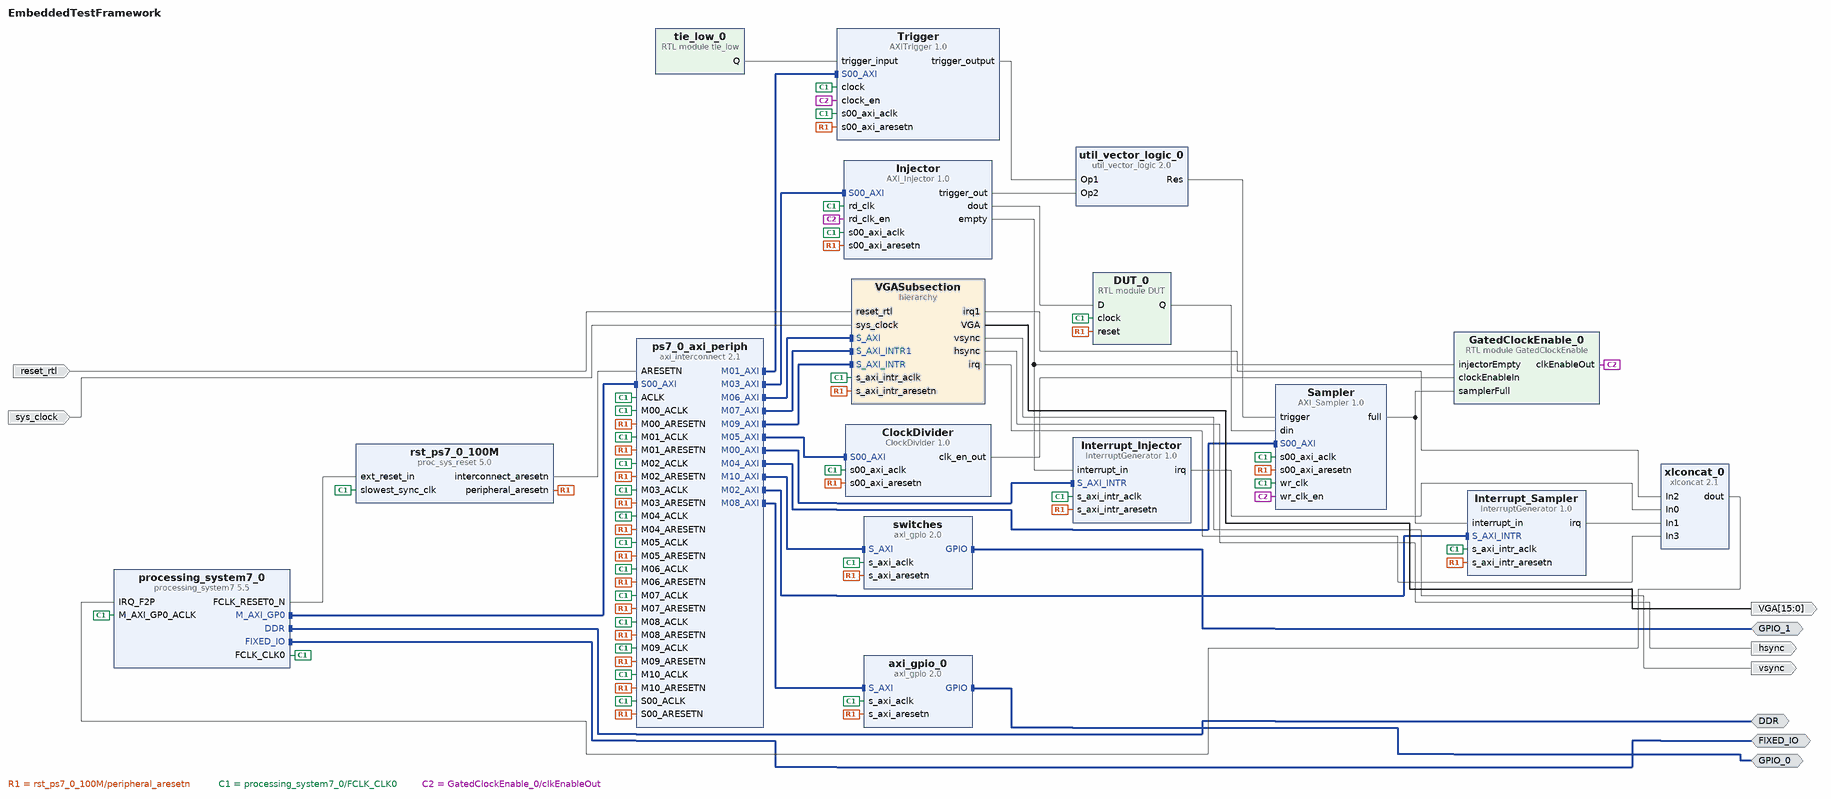
[diagram p0: block diagram of the top level]
# Vivado block design EmbeddedTestFramework, xc7z010clg400-1, Vivado 2018.2
create_bd_design EmbeddedTestFramework

create_bd_intf_port -mode Master -vlnv xilinx.com:interface:ddrx_rtl:1.0 DDR
create_bd_intf_port -mode Master -vlnv xilinx.com:display_processing_system7:fixedio_rtl:1.0 FIXED_IO
create_bd_intf_port -mode Master -vlnv xilinx.com:interface:gpio_rtl:1.0 GPIO_1
create_bd_intf_port -mode Master -vlnv xilinx.com:interface:gpio_rtl:1.0 GPIO_0
create_bd_port -dir I -type rst reset_rtl
set_property -dict {CONFIG.POLARITY ACTIVE_HIGH} [get_bd_ports reset_rtl]
create_bd_port -dir I -type clk sys_clock
set_property -dict {CONFIG.FREQ_HZ 125000000 CONFIG.PHASE 0.000} [get_bd_ports sys_clock]
create_bd_port -dir O -from 15 -to 0 VGA
create_bd_port -dir O vsync
create_bd_port -dir O hsync

create_bd_cell -type ip -vlnv xilinx.com:ip:xlconcat:2.1 xlconcat_0
set_property -dict {CONFIG.NUM_PORTS 4} [get_bd_cells xlconcat_0]
create_bd_cell -type ip -vlnv xilinx.com:ip:axi_interconnect:2.1 ps7_0_axi_periph
set_property -dict [list \
  CONFIG.NUM_MI 11 \
  CONFIG.STRATEGY 2 \
  CONFIG.ENABLE_ADVANCED_OPTIONS 1 \
  CONFIG.M00_HAS_REGSLICE 3 \
  CONFIG.M01_HAS_REGSLICE 3 \
  CONFIG.M02_HAS_REGSLICE 3 \
  CONFIG.M03_HAS_REGSLICE 3 \
  CONFIG.M04_HAS_REGSLICE 3 \
  CONFIG.M05_HAS_REGSLICE 3 \
  CONFIG.M06_HAS_REGSLICE 3 \
  CONFIG.M07_HAS_REGSLICE 3 \
  CONFIG.M08_HAS_REGSLICE 3 \
  CONFIG.M09_HAS_REGSLICE 3 \
  CONFIG.M10_HAS_REGSLICE 3 \
  CONFIG.M00_HAS_DATA_FIFO 0 \
  CONFIG.M01_HAS_DATA_FIFO 0 \
  CONFIG.M02_HAS_DATA_FIFO 0 \
  CONFIG.M03_HAS_DATA_FIFO 0 \
  CONFIG.M04_HAS_DATA_FIFO 0 \
  CONFIG.M05_HAS_DATA_FIFO 0 \
  CONFIG.M06_HAS_DATA_FIFO 0 \
  CONFIG.M07_HAS_DATA_FIFO 0 \
  CONFIG.M08_HAS_DATA_FIFO 0 \
  CONFIG.M09_HAS_DATA_FIFO 0 \
  CONFIG.M10_HAS_DATA_FIFO 0 \
  CONFIG.S00_HAS_DATA_FIFO 2 \
] [get_bd_cells ps7_0_axi_periph]
create_bd_cell -type module -reference tie_low tie_low_0
create_bd_cell -type module -reference DUT DUT_0
create_bd_cell -type hier VGASubsection
create_bd_cell -type module -reference GatedClockEnable GatedClockEnable_0
create_bd_cell -type ip -vlnv xilinx.com:ip:util_vector_logic:2.0 util_vector_logic_0
set_property -dict {CONFIG.C_SIZE 2 CONFIG.C_OPERATION or} [get_bd_cells util_vector_logic_0]
create_bd_cell -type ip -vlnv xilinx.com:ip:axi_gpio:2.0 axi_gpio_0
set_property -dict [list \
  CONFIG.C_GPIO_WIDTH 4 \
  CONFIG.USE_BOARD_FLOW true \
  CONFIG.GPIO_BOARD_INTERFACE Custom \
  CONFIG.C_ALL_OUTPUTS 1 \
] [get_bd_cells axi_gpio_0]
create_bd_cell -type ip -vlnv xilinx.com:ip:axi_gpio:2.0 switches
set_property -dict {CONFIG.C_GPIO_WIDTH 4 CONFIG.C_ALL_INPUTS 1} [get_bd_cells switches]
create_bd_cell -type ip -vlnv xilinx.com:ip:processing_system7:5.5 processing_system7_0
set_property -dict [list \
  CONFIG.PCW_UIPARAM_DDR_FREQ_MHZ 525 \
  CONFIG.PCW_CRYSTAL_PERIPHERAL_FREQMHZ 50.000000 \
  CONFIG.PCW_APU_PERIPHERAL_FREQMHZ 650 \
  CONFIG.PCW_UART_PERIPHERAL_FREQMHZ 100 \
  CONFIG.PCW_FPGA0_PERIPHERAL_FREQMHZ 200 \
  CONFIG.PCW_FPGA1_PERIPHERAL_FREQMHZ 50 \
  CONFIG.PCW_USE_FABRIC_INTERRUPT 1 \
  CONFIG.PCW_IRQ_F2P_INTR 1 \
  CONFIG.PCW_PERIPHERAL_BOARD_PRESET part0 \
  CONFIG.PCW_PRESET_BANK1_VOLTAGE {LVCMOS 1.8V} \
  CONFIG.PCW_UIPARAM_DDR_PARTNO {MT41K128M16 JT-125} \
  CONFIG.PCW_QSPI_PERIPHERAL_ENABLE 0 \
  CONFIG.PCW_ENET0_PERIPHERAL_ENABLE 0 \
  CONFIG.PCW_SD0_PERIPHERAL_ENABLE 0 \
  CONFIG.PCW_UART1_PERIPHERAL_ENABLE 1 \
  CONFIG.PCW_UART1_UART1_IO {MIO 48 .. 49} \
  CONFIG.PCW_USB0_PERIPHERAL_ENABLE 0 \
  CONFIG.PCW_GPIO_MIO_GPIO_ENABLE 0 \
] [get_bd_cells processing_system7_0]
# 343 more settings of processing_system7_0 are not shown: defaults, MIO pin electricals, DDR timing, and values the tool derives
create_bd_cell -type ip -vlnv xilinx.com:ip:proc_sys_reset:5.0 rst_ps7_0_100M
create_bd_cell -type ip -vlnv xilinx.com:user:AXITrigger:1.0 Trigger
create_bd_cell -type ip -vlnv xilinx.com:user:AXI_Injector:1.0 Injector
create_bd_cell -type ip -vlnv xilinx.com:user:AXI_Sampler:1.0 Sampler
create_bd_cell -type ip -vlnv xilinx.com:user:ClockDivider:1.0 ClockDivider
create_bd_cell -type ip -vlnv xilinx.com:user:InterruptGenerator:1.0 Interrupt_Injector
create_bd_cell -type ip -vlnv xilinx.com:user:InterruptGenerator:1.0 Interrupt_Sampler

# ---- hierarchy /VGASubsection ----
current_bd_instance /VGASubsection
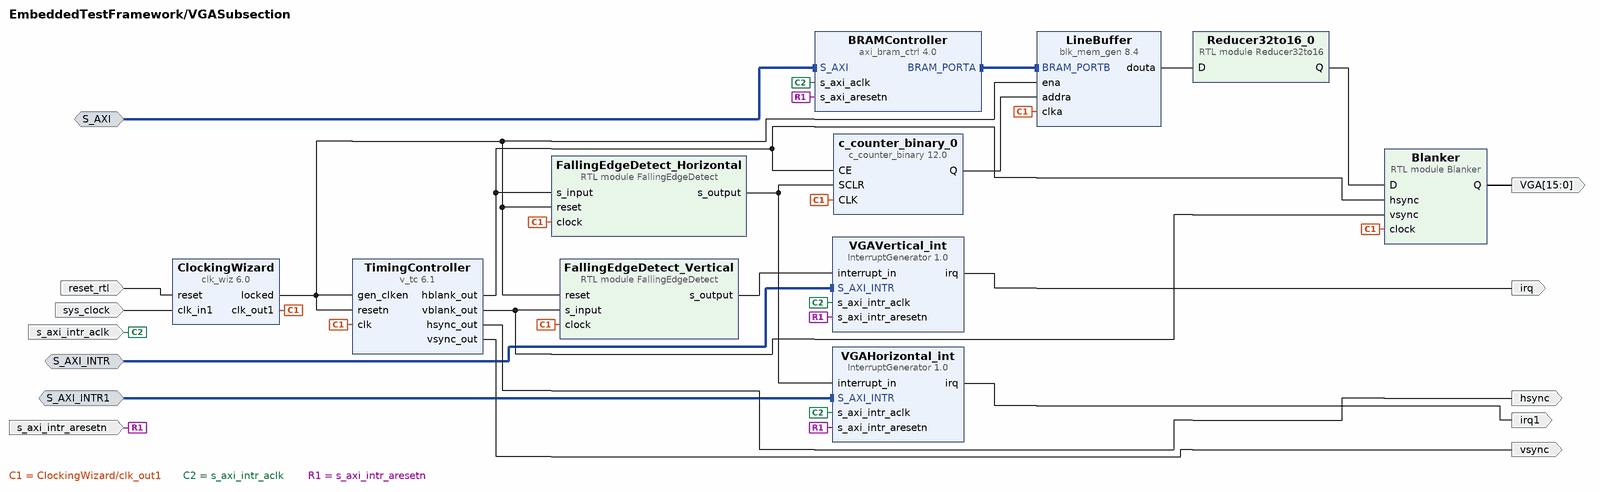
[diagram p1: block diagram inside /VGASubsection]
create_bd_intf_pin -mode Slave -vlnv xilinx.com:interface:aximm_rtl:1.0 S_AXI
create_bd_intf_pin -mode Slave -vlnv xilinx.com:interface:aximm_rtl:1.0 S_AXI_INTR
create_bd_intf_pin -mode Slave -vlnv xilinx.com:interface:aximm_rtl:1.0 S_AXI_INTR1
create_bd_pin -dir O -from 15 -to 0 VGA
create_bd_pin -dir I -type clk s_axi_intr_aclk
create_bd_pin -dir I -type rst s_axi_intr_aresetn
create_bd_pin -dir O -type intr irq
create_bd_pin -dir O -type intr irq1
create_bd_pin -dir O hsync
create_bd_pin -dir O vsync
create_bd_pin -dir I -type rst reset_rtl
create_bd_pin -dir I -type clk sys_clock

create_bd_cell -type module -reference Blanker Blanker
create_bd_cell -type ip -vlnv xilinx.com:ip:axi_bram_ctrl:4.0 BRAMController
set_property -dict {CONFIG.SINGLE_PORT_BRAM 1} [get_bd_cells BRAMController]
create_bd_cell -type module -reference Reducer32to16 Reducer32to16_0
create_bd_cell -type ip -vlnv xilinx.com:ip:blk_mem_gen:8.4 LineBuffer
set_property -dict [list \
  CONFIG.Memory_Type True_Dual_Port_RAM \
  CONFIG.Enable_32bit_Address true \
  CONFIG.Enable_B Use_ENB_Pin \
  CONFIG.Register_PortA_Output_of_Memory_Primitives false \
  CONFIG.Register_PortB_Output_of_Memory_Primitives false \
  CONFIG.Use_RSTA_Pin true \
  CONFIG.Use_RSTB_Pin true \
  CONFIG.Port_B_Clock 100 \
  CONFIG.Port_B_Write_Rate 50 \
  CONFIG.Port_B_Enable_Rate 100 \
  CONFIG.use_bram_block BRAM_Controller \
  CONFIG.EN_SAFETY_CKT true \
] [get_bd_cells LineBuffer]
create_bd_cell -type ip -vlnv xilinx.com:ip:v_tc:6.1 TimingController
set_property -dict [list \
  CONFIG.HAS_AXI4_LITE false \
  CONFIG.VIDEO_MODE 640x480p \
  CONFIG.FSYNC_HSTART0 640 \
  CONFIG.FSYNC_VSTART0 480 \
  CONFIG.GEN_HSYNC_POLARITY Low \
  CONFIG.GEN_VSYNC_POLARITY Low \
  CONFIG.GEN_HBLANK_POLARITY Low \
  CONFIG.GEN_VBLANK_POLARITY Low \
  CONFIG.enable_detection false \
  CONFIG.frame_syncs 1 \
] [get_bd_cells TimingController]
create_bd_cell -type module -reference FallingEdgeDetect FallingEdgeDetect_Horizontal
create_bd_cell -type module -reference FallingEdgeDetect FallingEdgeDetect_Vertical
create_bd_cell -type ip -vlnv xilinx.com:ip:c_counter_binary:12.0 c_counter_binary_0
set_property -dict [list \
  CONFIG.Output_Width 32 \
  CONFIG.Increment_Value 4 \
  CONFIG.Restrict_Count true \
  CONFIG.Final_Count_Value 2600 \
  CONFIG.Sync_Threshold_Output false \
  CONFIG.CE true \
  CONFIG.SCLR true \
  CONFIG.Load false \
] [get_bd_cells c_counter_binary_0]
create_bd_cell -type ip -vlnv xilinx.com:ip:clk_wiz:6.0 ClockingWizard
set_property -dict [list \
  CONFIG.CLKIN1_JITTER_PS 80.0 \
  CONFIG.CLKOUT1_REQUESTED_OUT_FREQ 25.175 \
  CONFIG.MMCM_DIVCLK_DIVIDE 7 \
  CONFIG.MMCM_CLKFBOUT_MULT_F 61.500 \
  CONFIG.MMCM_CLKIN1_PERIOD 8.000 \
  CONFIG.MMCM_CLKOUT0_DIVIDE_F 43.625 \
  CONFIG.USE_BOARD_FLOW true \
  CONFIG.CLK_IN1_BOARD_INTERFACE sys_clock \
  CONFIG.CLKOUT1_JITTER 281.423 \
  CONFIG.CLKOUT1_PHASE_ERROR 365.405 \
] [get_bd_cells ClockingWizard]
create_bd_cell -type ip -vlnv xilinx.com:user:InterruptGenerator:1.0 VGAHorizontal_int
create_bd_cell -type ip -vlnv xilinx.com:user:InterruptGenerator:1.0 VGAVertical_int

# ---- connections ----

current_bd_instance /VGASubsection
connect_bd_intf_net -intf_net axi_bram_ctrl_0_BRAM_PORTA [get_bd_intf_pins BRAMController/BRAM_PORTA] [get_bd_intf_pins LineBuffer/BRAM_PORTB]
connect_bd_intf_net [get_bd_intf_pins S_AXI] [get_bd_intf_pins BRAMController/S_AXI]
connect_bd_intf_net [get_bd_intf_pins S_AXI_INTR] [get_bd_intf_pins VGAVertical_int/S_AXI_INTR]
connect_bd_intf_net [get_bd_intf_pins S_AXI_INTR1] [get_bd_intf_pins VGAHorizontal_int/S_AXI_INTR]
connect_bd_net [get_bd_pins Reducer32to16_0/Q] [get_bd_pins Blanker/D]
connect_bd_net -net clk_wiz_0_clk_out1 [get_bd_pins ClockingWizard/clk_out1] \
  [get_bd_pins TimingController/clk] [get_bd_pins Blanker/clock] [get_bd_pins LineBuffer/clka] \
  [get_bd_pins FallingEdgeDetect_Horizontal/clock] [get_bd_pins FallingEdgeDetect_Vertical/clock] \
  [get_bd_pins c_counter_binary_0/CLK]
connect_bd_net -net v_tc_0_hblank_out [get_bd_pins TimingController/hblank_out] \
  [get_bd_pins Blanker/hsync] [get_bd_pins FallingEdgeDetect_Horizontal/s_input] [get_bd_pins c_counter_binary_0/CE]
connect_bd_net -net v_tc_0_vblank_out [get_bd_pins TimingController/vblank_out] \
  [get_bd_pins Blanker/vsync] [get_bd_pins FallingEdgeDetect_Vertical/s_input]
connect_bd_net -net FallingEdgeDetect_1_output [get_bd_pins FallingEdgeDetect_Vertical/s_output] [get_bd_pins VGAVertical_int/interrupt_in]
connect_bd_net -net clk_wiz_0_locked [get_bd_pins ClockingWizard/locked] \
  [get_bd_pins TimingController/resetn] [get_bd_pins TimingController/gen_clken] [get_bd_pins LineBuffer/ena] \
  [get_bd_pins FallingEdgeDetect_Horizontal/reset] [get_bd_pins FallingEdgeDetect_Vertical/reset]
connect_bd_net -net blk_mem_gen_0_douta [get_bd_pins LineBuffer/douta] [get_bd_pins Reducer32to16_0/D]
connect_bd_net -net Blanker_0_Q [get_bd_pins Blanker/Q] [get_bd_pins VGA]
connect_bd_net -net processing_system7_0_FCLK_CLK0 [get_bd_pins s_axi_intr_aclk] \
  [get_bd_pins BRAMController/s_axi_aclk] [get_bd_pins VGAHorizontal_int/s_axi_intr_aclk] \
  [get_bd_pins VGAVertical_int/s_axi_intr_aclk]
connect_bd_net -net rst_ps7_0_100M_peripheral_aresetn [get_bd_pins s_axi_intr_aresetn] \
  [get_bd_pins BRAMController/s_axi_aresetn] [get_bd_pins VGAHorizontal_int/s_axi_intr_aresetn] \
  [get_bd_pins VGAVertical_int/s_axi_intr_aresetn]
connect_bd_net -net InterruptGenerator_0_irq2 [get_bd_pins VGAVertical_int/irq] [get_bd_pins irq]
connect_bd_net -net InterruptGenerator_0_irq1 [get_bd_pins VGAHorizontal_int/irq] [get_bd_pins irq1]
connect_bd_net -net v_tc_0_hsync_out [get_bd_pins TimingController/hsync_out] [get_bd_pins hsync]
connect_bd_net -net v_tc_0_vsync_out [get_bd_pins TimingController/vsync_out] [get_bd_pins vsync]
connect_bd_net [get_bd_pins reset_rtl] [get_bd_pins ClockingWizard/reset]
connect_bd_net [get_bd_pins sys_clock] [get_bd_pins ClockingWizard/clk_in1]
connect_bd_net [get_bd_pins FallingEdgeDetect_Horizontal/s_output] [get_bd_pins c_counter_binary_0/SCLR] [get_bd_pins VGAHorizontal_int/interrupt_in]
connect_bd_net [get_bd_pins c_counter_binary_0/Q] [get_bd_pins LineBuffer/addra]

current_bd_instance /
connect_bd_intf_net [get_bd_intf_pins processing_system7_0/M_AXI_GP0] [get_bd_intf_pins ps7_0_axi_periph/S00_AXI]
connect_bd_intf_net [get_bd_intf_pins ps7_0_axi_periph/M00_AXI] [get_bd_intf_pins Interrupt_Injector/S_AXI_INTR]
connect_bd_intf_net [get_bd_intf_pins ps7_0_axi_periph/M01_AXI] [get_bd_intf_pins Trigger/S00_AXI]
connect_bd_intf_net [get_bd_intf_pins ps7_0_axi_periph/M02_AXI] [get_bd_intf_pins Interrupt_Sampler/S_AXI_INTR]
connect_bd_intf_net [get_bd_intf_pins ps7_0_axi_periph/M03_AXI] [get_bd_intf_pins Injector/S00_AXI]
connect_bd_intf_net [get_bd_intf_pins ps7_0_axi_periph/M04_AXI] [get_bd_intf_pins Sampler/S00_AXI]
connect_bd_intf_net [get_bd_intf_pins ps7_0_axi_periph/M05_AXI] [get_bd_intf_pins ClockDivider/S00_AXI]
connect_bd_intf_net [get_bd_intf_pins ps7_0_axi_periph/M08_AXI] [get_bd_intf_pins axi_gpio_0/S_AXI]
connect_bd_intf_net [get_bd_intf_pins ps7_0_axi_periph/M06_AXI] [get_bd_intf_pins VGASubsection/S_AXI]
connect_bd_intf_net [get_bd_intf_pins ps7_0_axi_periph/M07_AXI] [get_bd_intf_pins VGASubsection/S_AXI_INTR1]
connect_bd_intf_net [get_bd_intf_pins ps7_0_axi_periph/M09_AXI] [get_bd_intf_pins VGASubsection/S_AXI_INTR]
connect_bd_intf_net [get_bd_intf_pins ps7_0_axi_periph/M10_AXI] [get_bd_intf_pins switches/S_AXI]
connect_bd_intf_net [get_bd_intf_ports DDR] [get_bd_intf_pins processing_system7_0/DDR]
connect_bd_intf_net [get_bd_intf_ports FIXED_IO] [get_bd_intf_pins processing_system7_0/FIXED_IO]
connect_bd_intf_net [get_bd_intf_ports GPIO_1] [get_bd_intf_pins switches/GPIO]
connect_bd_intf_net [get_bd_intf_ports GPIO_0] [get_bd_intf_pins axi_gpio_0/GPIO]
connect_bd_net [get_bd_pins xlconcat_0/dout] [get_bd_pins processing_system7_0/IRQ_F2P]
connect_bd_net -net AXITrigger_0_trigger_output [get_bd_pins Trigger/trigger_output] [get_bd_pins util_vector_logic_0/Op1]
connect_bd_net -net AXI_Sampler_0_full [get_bd_pins Sampler/full] \
  [get_bd_pins GatedClockEnable_0/samplerFull] [get_bd_pins Interrupt_Sampler/interrupt_in]
connect_bd_net [get_bd_pins processing_system7_0/FCLK_RESET0_N] [get_bd_pins rst_ps7_0_100M/ext_reset_in]
connect_bd_net [get_bd_pins rst_ps7_0_100M/peripheral_aresetn] \
  [get_bd_pins DUT_0/reset] [get_bd_pins axi_gpio_0/s_axi_aresetn] [get_bd_pins switches/s_axi_aresetn] \
  [get_bd_pins ps7_0_axi_periph/S00_ARESETN] [get_bd_pins ps7_0_axi_periph/M00_ARESETN] \
  [get_bd_pins ps7_0_axi_periph/M01_ARESETN] [get_bd_pins ps7_0_axi_periph/M02_ARESETN] \
  [get_bd_pins ps7_0_axi_periph/M03_ARESETN] [get_bd_pins ps7_0_axi_periph/M04_ARESETN] \
  [get_bd_pins ps7_0_axi_periph/M05_ARESETN] [get_bd_pins ps7_0_axi_periph/M06_ARESETN] \
  [get_bd_pins ps7_0_axi_periph/M07_ARESETN] [get_bd_pins ps7_0_axi_periph/M08_ARESETN] \
  [get_bd_pins ps7_0_axi_periph/M09_ARESETN] [get_bd_pins VGASubsection/s_axi_intr_aresetn] \
  [get_bd_pins ps7_0_axi_periph/M10_ARESETN] [get_bd_pins Trigger/s00_axi_aresetn] [get_bd_pins Injector/s00_axi_aresetn] \
  [get_bd_pins Sampler/s00_axi_aresetn] [get_bd_pins ClockDivider/s00_axi_aresetn] \
  [get_bd_pins Interrupt_Injector/s_axi_intr_aresetn] [get_bd_pins Interrupt_Sampler/s_axi_intr_aresetn]
connect_bd_net [get_bd_pins rst_ps7_0_100M/interconnect_aresetn] [get_bd_pins ps7_0_axi_periph/ARESETN]
connect_bd_net [get_bd_pins tie_low_0/Q] [get_bd_pins Trigger/trigger_input]
connect_bd_net -net AXI_Injector_0_empty [get_bd_pins Injector/empty] \
  [get_bd_pins GatedClockEnable_0/injectorEmpty] [get_bd_pins Interrupt_Injector/interrupt_in]
connect_bd_net -net InterruptGenerator_0_irq [get_bd_pins Interrupt_Injector/irq] [get_bd_pins xlconcat_0/In0]
connect_bd_net -net InterruptGenerator_1_irq [get_bd_pins Interrupt_Sampler/irq] [get_bd_pins xlconcat_0/In1]
connect_bd_net -net AXI_Injector_0_dout [get_bd_pins Injector/dout] [get_bd_pins DUT_0/D]
connect_bd_net [get_bd_pins DUT_0/Q] [get_bd_pins Sampler/din]
connect_bd_net [get_bd_pins processing_system7_0/FCLK_CLK0] \
  [get_bd_pins DUT_0/clock] [get_bd_pins axi_gpio_0/s_axi_aclk] [get_bd_pins switches/s_axi_aclk] \
  [get_bd_pins processing_system7_0/M_AXI_GP0_ACLK] [get_bd_pins rst_ps7_0_100M/slowest_sync_clk] \
  [get_bd_pins ps7_0_axi_periph/S00_ACLK] [get_bd_pins ps7_0_axi_periph/M00_ACLK] [get_bd_pins ps7_0_axi_periph/M01_ACLK] \
  [get_bd_pins ps7_0_axi_periph/M02_ACLK] [get_bd_pins ps7_0_axi_periph/M03_ACLK] [get_bd_pins ps7_0_axi_periph/M04_ACLK] \
  [get_bd_pins ps7_0_axi_periph/ACLK] [get_bd_pins ps7_0_axi_periph/M05_ACLK] [get_bd_pins ps7_0_axi_periph/M06_ACLK] \
  [get_bd_pins ps7_0_axi_periph/M07_ACLK] [get_bd_pins ps7_0_axi_periph/M08_ACLK] [get_bd_pins ps7_0_axi_periph/M09_ACLK] \
  [get_bd_pins VGASubsection/s_axi_intr_aclk] [get_bd_pins ps7_0_axi_periph/M10_ACLK] [get_bd_pins Trigger/clock] \
  [get_bd_pins Trigger/s00_axi_aclk] [get_bd_pins Injector/rd_clk] [get_bd_pins Injector/s00_axi_aclk] \
  [get_bd_pins Sampler/wr_clk] [get_bd_pins Sampler/s00_axi_aclk] [get_bd_pins ClockDivider/s00_axi_aclk] \
  [get_bd_pins Interrupt_Injector/s_axi_intr_aclk] [get_bd_pins Interrupt_Sampler/s_axi_intr_aclk]
connect_bd_net [get_bd_ports reset_rtl] [get_bd_pins VGASubsection/reset_rtl]
connect_bd_net [get_bd_ports sys_clock] [get_bd_pins VGASubsection/sys_clock]
connect_bd_net -net Blanker_0_Q [get_bd_pins VGASubsection/VGA] [get_bd_ports VGA]
connect_bd_net -net v_tc_0_vsync_out [get_bd_pins VGASubsection/vsync] [get_bd_ports vsync]
connect_bd_net -net v_tc_0_hsync_out [get_bd_pins VGASubsection/hsync] [get_bd_ports hsync]
connect_bd_net -net InterruptGenerator_0_irq1 [get_bd_pins VGASubsection/irq1] [get_bd_pins xlconcat_0/In2]
connect_bd_net -net InterruptGenerator_0_irq2 [get_bd_pins VGASubsection/irq] [get_bd_pins xlconcat_0/In3]
connect_bd_net [get_bd_pins ClockDivider/clk_en_out] [get_bd_pins GatedClockEnable_0/clockEnableIn]
connect_bd_net [get_bd_pins GatedClockEnable_0/clkEnableOut] \
  [get_bd_pins Trigger/clock_en] [get_bd_pins Injector/rd_clk_en] [get_bd_pins Sampler/wr_clk_en]
connect_bd_net [get_bd_pins util_vector_logic_0/Res] [get_bd_pins Sampler/trigger]
connect_bd_net [get_bd_pins Injector/trigger_out] [get_bd_pins util_vector_logic_0/Op2]

# ---- address map ----
assign_bd_address -offset 0x40000000 -range 8K -target_address_space [get_bd_addr_spaces processing_system7_0/Data] [get_bd_addr_segs VGASubsection/BRAMController/S_AXI/Mem0]
assign_bd_address -offset 0x41200000 -range 64K -target_address_space [get_bd_addr_spaces processing_system7_0/Data] [get_bd_addr_segs axi_gpio_0/S_AXI/Reg]
assign_bd_address -offset 0x41210000 -range 64K -target_address_space [get_bd_addr_spaces processing_system7_0/Data] [get_bd_addr_segs switches/S_AXI/Reg]
assign_bd_address -offset 0x43C00000 -range 64K -target_address_space [get_bd_addr_spaces processing_system7_0/Data] [get_bd_addr_segs Interrupt_Injector/S_AXI_INTR/S_AXI_INTR_reg]
assign_bd_address -offset 0x43C10000 -range 64K -target_address_space [get_bd_addr_spaces processing_system7_0/Data] [get_bd_addr_segs Interrupt_Sampler/S_AXI_INTR/S_AXI_INTR_reg]
assign_bd_address -offset 0x43C20000 -range 64K -target_address_space [get_bd_addr_spaces processing_system7_0/Data] [get_bd_addr_segs VGASubsection/VGAHorizontal_int/S_AXI_INTR/S_AXI_INTR_reg]
assign_bd_address -offset 0x43C30000 -range 64K -target_address_space [get_bd_addr_spaces processing_system7_0/Data] [get_bd_addr_segs VGASubsection/VGAVertical_int/S_AXI_INTR/S_AXI_INTR_reg]
assign_bd_address -offset 0x7AA00000 -range 64K -target_address_space [get_bd_addr_spaces processing_system7_0/Data] [get_bd_addr_segs Trigger/S00_AXI/S00_AXI_mem]
assign_bd_address -offset 0x7AA10000 -range 64K -target_address_space [get_bd_addr_spaces processing_system7_0/Data] [get_bd_addr_segs Injector/S00_AXI/S00_AXI_mem]
assign_bd_address -offset 0x7AA20000 -range 64K -target_address_space [get_bd_addr_spaces processing_system7_0/Data] [get_bd_addr_segs Sampler/S00_AXI/S00_AXI_mem]
assign_bd_address -offset 0x7AA30000 -range 64K -target_address_space [get_bd_addr_spaces processing_system7_0/Data] [get_bd_addr_segs ClockDivider/S00_AXI/S00_AXI_mem]

validate_bd_design
save_bd_design
